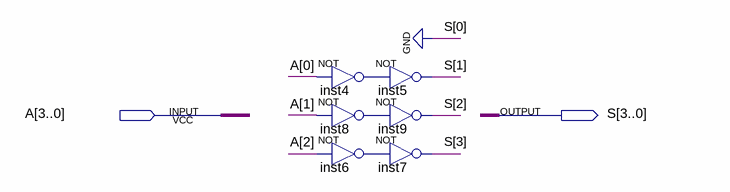
[diagram p0: schematic sheet]
// Quartus schematic MULTIPLICADOR4.bdf as structural Verilog: 6 symbols, 2 pins
module MULTIPLICADOR4 (
  input  [3:0] A,
  output [3:0] S
);

  wire inst4_out, inst6_out, inst8_out;

  not inst4 (inst4_out, A[0]);
  not inst8 (inst8_out, A[1]);
  not inst6 (inst6_out, A[2]);
  not inst5 (S[1], inst4_out);
  not inst9 (S[2], inst8_out);
  not inst7 (S[3], inst6_out);

  assign S[0] = 1'b0;
endmodule
